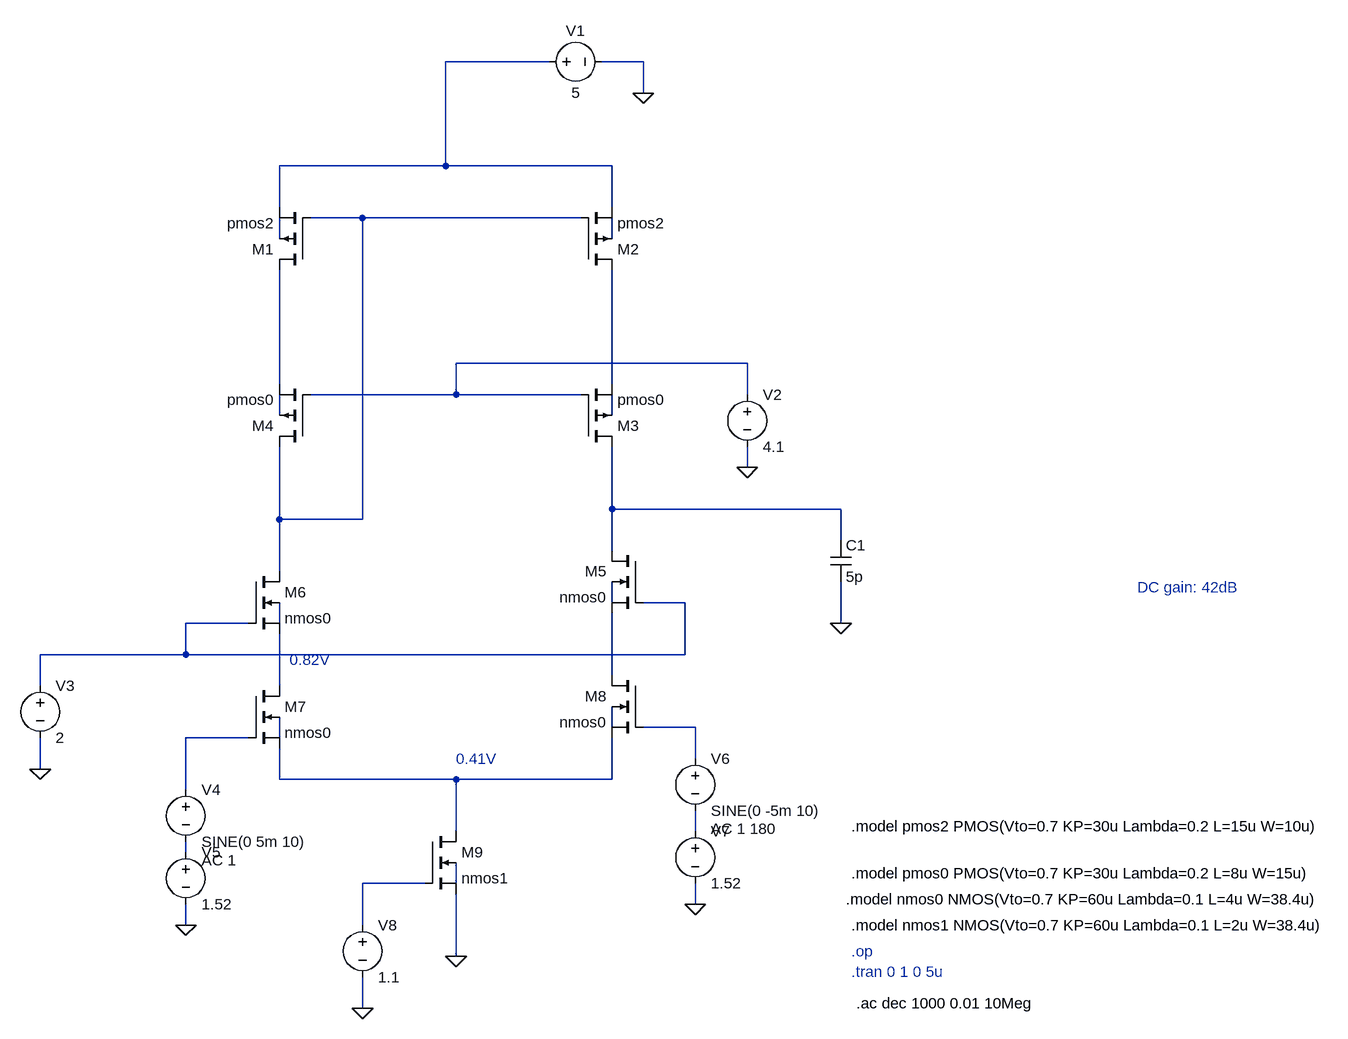
[diagram p0: schematic telescopic opamp.asc]
telescopic opamp.asc, the LTspice schematic file:
Version 4.1
SHEET 1 1896 1268
WIRE 512 -208 352 -208
WIRE 656 -208 592 -208
WIRE 656 -160 656 -208
WIRE 352 -48 352 -208
WIRE 352 -48 96 -48
WIRE 608 -48 352 -48
WIRE 96 16 96 -48
WIRE 608 16 608 -48
WIRE 224 32 144 32
WIRE 560 32 224 32
WIRE 96 64 96 32
WIRE 608 64 608 32
WIRE 816 256 368 256
WIRE 96 288 96 112
WIRE 608 288 608 112
WIRE 368 304 368 256
WIRE 368 304 144 304
WIRE 560 304 368 304
WIRE 816 304 816 256
WIRE 96 336 96 304
WIRE 608 336 608 304
WIRE 816 416 816 384
WIRE 608 480 608 384
WIRE 960 480 608 480
WIRE 96 496 96 384
WIRE 224 496 224 32
WIRE 224 496 96 496
WIRE 960 528 960 480
WIRE 608 544 608 480
WIRE 96 576 96 496
WIRE 608 624 608 592
WIRE 720 624 656 624
WIRE 48 656 -48 656
WIRE 96 656 96 624
WIRE 960 656 960 592
WIRE -48 704 -48 656
WIRE -48 704 -272 704
WIRE 720 704 720 624
WIRE 720 704 -48 704
WIRE 608 736 608 640
WIRE -272 752 -272 704
WIRE 96 752 96 672
WIRE 608 816 608 784
WIRE 736 816 656 816
WIRE 48 832 -48 832
WIRE 96 832 96 800
WIRE 736 864 736 816
WIRE -272 880 -272 832
WIRE 96 896 96 848
WIRE 368 896 96 896
WIRE 608 896 608 832
WIRE 608 896 368 896
WIRE -48 912 -48 832
WIRE 368 976 368 896
WIRE 736 976 736 944
WIRE -48 1008 -48 992
WIRE 320 1056 224 1056
WIRE 368 1056 368 1024
WIRE 736 1088 736 1056
WIRE -48 1120 -48 1088
WIRE 224 1120 224 1056
WIRE 368 1168 368 1072
WIRE 224 1248 224 1200
FLAG 368 1168 0
FLAG 656 -160 0
FLAG 816 416 0
FLAG 960 656 0
FLAG -272 880 0
FLAG -48 1120 0
FLAG 736 1088 0
FLAG 224 1248 0
SYMBOL nmos4 48 576 R0
SYMATTR InstName M6
SYMATTR Value nmos0
SYMBOL nmos4 48 752 R0
SYMATTR InstName M7
SYMATTR Value nmos0
SYMBOL nmos4 320 976 R0
SYMATTR InstName M9
SYMATTR Value nmos1
SYMBOL voltage 496 -208 R270
WINDOW 0 32 56 VTop 2
WINDOW 3 -32 56 VBottom 2
WINDOW 123 0 0 Left 0
WINDOW 39 0 0 Left 0
SYMATTR InstName V1
SYMATTR Value 5
SYMBOL voltage 816 288 R0
WINDOW 123 0 0 Left 0
WINDOW 39 0 0 Left 0
SYMATTR InstName V2
SYMATTR Value 4.1
SYMBOL cap 944 528 R0
SYMATTR InstName C1
SYMATTR Value 5p
SYMBOL voltage -272 736 R0
WINDOW 123 0 0 Left 0
WINDOW 39 0 0 Left 0
SYMATTR InstName V3
SYMATTR Value 2
SYMBOL voltage -48 896 R0
WINDOW 123 24 124 Left 2
WINDOW 39 0 0 Left 0
SYMATTR Value2 AC 1
SYMATTR InstName V4
SYMATTR Value SINE(0 5m 10)
SYMBOL voltage -48 992 R0
WINDOW 123 0 0 Left 0
WINDOW 39 0 0 Left 0
SYMATTR InstName V5
SYMATTR Value 1.52
SYMBOL voltage 736 848 R0
WINDOW 123 24 124 Left 2
WINDOW 39 0 0 Left 0
SYMATTR Value2 AC 1 180
SYMATTR InstName V6
SYMATTR Value SINE(0 -5m 10)
SYMBOL voltage 736 960 R0
WINDOW 123 0 0 Left 0
WINDOW 39 0 0 Left 0
SYMATTR InstName V7
SYMATTR Value 1.52
SYMBOL voltage 224 1104 R0
WINDOW 123 0 0 Left 0
WINDOW 39 0 0 Left 0
SYMATTR InstName V8
SYMATTR Value 1.1
SYMBOL lib\\sym\\nmos4 656 544 M0
SYMATTR InstName M5
SYMATTR Value nmos0
SYMBOL lib\\sym\\nmos4 656 736 M0
SYMATTR InstName M8
SYMATTR Value nmos0
SYMBOL lib\\sym\\pmos4 560 112 M180
SYMATTR InstName M2
SYMATTR Value pmos2
SYMBOL lib\\sym\\pmos4 560 384 M180
SYMATTR InstName M3
SYMATTR Value pmos0
SYMBOL lib\\sym\\pmos4 144 112 R180
SYMATTR InstName M1
SYMATTR Value pmos2
SYMBOL lib\\sym\\pmos4 144 384 R180
SYMATTR InstName M4
SYMATTR Value pmos0
TEXT 968 1080 Left 2 !.model nmos0 NMOS(Vto=0.7 KP=60u Lambda=0.1 L=4u W=38.4u)
TEXT 976 1040 Left 2 !.model pmos0 PMOS(Vto=0.7 KP=30u Lambda=0.2 L=8u W=15u)
TEXT 976 1160 Left 2 ;.op
TEXT 368 864 Left 2 ;0.41V
TEXT 112 712 Left 2 ;0.82V
TEXT 976 1192 Left 2 ;.tran 0 1 0 5u
TEXT 984 1240 Left 2 !.ac dec 1000 0.01 10Meg
TEXT 976 1120 Left 2 !.model nmos1 NMOS(Vto=0.7 KP=60u Lambda=0.1 L=2u W=38.4u)
TEXT 976 968 Left 2 !.model pmos2 PMOS(Vto=0.7 KP=30u Lambda=0.2 L=15u W=10u)
TEXT 1416 600 Left 2 ;DC gain: 42dB

The netlist it stands for:
* telescopic opamp.asc
M6 N002 N012 N015 N013 nmos0
M7 N015 N018 N020 N019 nmos0
M9 N020 N023 0 N024 nmos1
V1 N001 0 5
V2 N005 0 4.1
C1 N010 0 5p
V3 N012 0 2
V4 N018 N022 SINE(0 5m 10) AC 1
V5 N022 0 1.52
V6 N017 N021 SINE(0 -5m 10) AC 1 180
V7 N021 0 1.52
V8 N023 0 1.1
M5 N010 N012 N014 N011 nmos0
M8 N014 N017 N020 N016 nmos0
M2 N007 N002 N001 N004 pmos2
M3 N010 N005 N007 N009 pmos0
M1 N006 N002 N001 N003 pmos2
M4 N002 N005 N006 N008 pmos0
.model NMOS NMOS
.model PMOS PMOS
.lib standard.mos
.model nmos0 NMOS(Vto=0.7 KP=60u Lambda=0.1 L=4u W=38.4u)
.model pmos0 PMOS(Vto=0.7 KP=30u Lambda=0.2 L=8u W=15u)
* .op
* 0.41V
* 0.82V
* .tran 0 1 0 5u
.ac dec 1000 0.01 10Meg
.model nmos1 NMOS(Vto=0.7 KP=60u Lambda=0.1 L=2u W=38.4u)
.model pmos2 PMOS(Vto=0.7 KP=30u Lambda=0.2 L=15u W=10u)
* DC gain: 42dB
.backanno
.end